# EAGLE design amp (EAGLE 9.6.1)
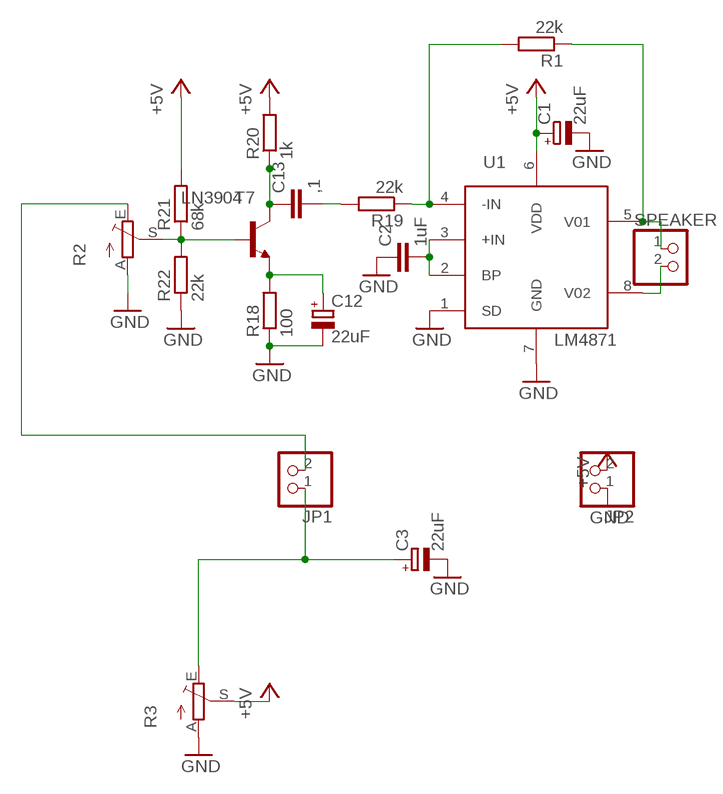
[diagram p0: schematic, sheet 1]

## Parts
C1  22uF  CPOL-EUCT3528  [CT3528]
C2  1uF  C-EUC0603  [C0603]
C3  22uF  CPOL-EUCT3528  [CT3528]
C12  22uF  CPOL-EUCT3528  [CT3528]
C13  ,1  C-EUC0603  [C0603]
JP1  PINHD-1X2  [1X02]
JP2  PINHD-1X2  [1X02]
R1  22k  R-EU_R0603  [R0603]
R2  TRIM_EU-LI15  [LI15]
R3  TRIM_EU-LI15  [LI15]
R18  100  R-EU_R0603  [R0603]
R19  22k  R-EU_R0603  [R0603]
R20  1k  R-EU_R0603  [R0603]
R21  68k  R-EU_R0603  [R0603]
R22  22k  R-EU_R0603  [R0603]
SPEAKER  PINHD-1X2  [1X02]
T7  LN3904  BC848-NPN-SOT23-BEC  [SOT23-BEC]
U1  LM4871  ICS_LM4871  [ICS_SOP08]

## Nets
+5V: C1.+ JP2.2 R3.S R20.2 R21.2 U1.6(VDD)
GND: C1.- C2.1 C3.- C12.- JP2.1 R2.A R3.A R18.1 R22.1 U1.1(SD) U1.7(GND)
N$1: R1.2 R19.1 U1.4(-IN)
N$2: C2.2 U1.2(BP) U1.3(+IN)
N$3: R1.1 SPEAKER.1 U1.5(V01)
N$4: SPEAKER.2 U1.8(V02)
N$5: JP1.2 R2.E
N$6: C3.+ JP1.1 R3.E
N$22: C12.+ R18.2 T7.E
N$23: C13.1 R20.1 T7.C
N$24: C13.2 R19.2
N$25: R2.S R21.1 R22.2 T7.B

## Library data of the parts
C1 C3 C12 = rcl:CPOL-EU: POLARIZED CAPACITOR, European symbol
C2 C13 = rcl:C-EU: CAPACITOR, European symbol
JP1 JP2 SPEAKER = pinhead:PINHD-1X2: PIN HEADER
R1 R18-R22 = resistor:R-EU_: RESISTOR, European symbol
R2 R3 = pot:TRIM_EU-: POTENTIOMETER
T7 = transistor:*-NPN-: NPN Transistror BF959 corrected 2008.03.06
U1 = magictale:ICS_LM4871

## Net classes
1 power: width 0.508 mm, drill 0.508 mm, clearance 0.254 mm

## Board
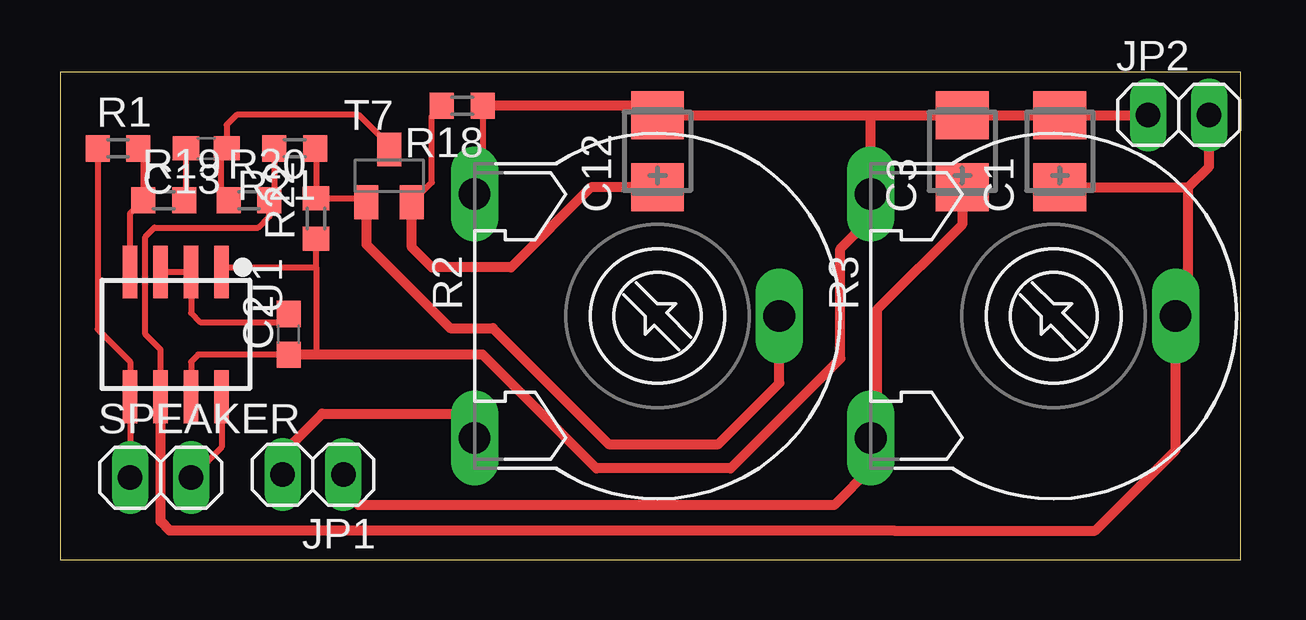
[diagram p1: board, top side]

Size 49.2 x 20.31 mm. Coordinates in mm from the lower left corner, seen from the top.
Outline: 0,0 49.2,0 49.2,20.31 0,20.31 0,0
Copper layers (1*16): Top 0.035mm / dielectric 1.5mm / Bottom 0.035mm
Design rules "default": minimum track width 6mil, minimum drill 0.35mm, track to track 6mil, track to pad 6mil, pad to pad 6mil, via to via 6mil, smd to smd 6mil, copper to edge 40mil, drill to drill 6mil, minimum pad ring 10mil, minimum via ring 8mil, stop-mask expansion 4mil, vias tented up to drill 0mil, thermal gap 10mil

### Footprints (pad centres in the part's own frame; a part is rotated, then mirrored left to right if it is on the bottom)
CT3528 = smd 2 x 2.2: + -1.5,0; - 1.5,0
C0603 = smd 1.1 x 1: 1 -0.85,0; 2 0.85,0
1X02 = drill 1.016 long: 1 -1.27,0; 2 1.27,0
R0603 = smd 1 x 1.1: 1 -0.85,0; 2 0.85,0
LI15 = drill 1.321 long: A -5.08,-7.62; E 5.08,-7.62; S 0,5.08
SOT23-BEC = smd 1 x 1.4: B -0.95,-1.1; C 0,1.1; E 0.95,-1.1
ICS_SOP08 = smd 0.6 x 2.2: 1 -1.905,-2.6; 2 -0.635,-2.6; 3 0.635,-2.6; 4 1.905,-2.6; 5 1.905,2.6; 6 0.635,2.6; 7 -0.635,2.6; 8 -1.905,2.6

### Placement (x,y rotation side)
C1  41.66,17.02 90 top
C2  9.53,9.4 90 top
C3  37.59,17.02 90 top
C12  24.89,17.02 90 top
C13  6.1,17.14 180 top
JP1  10.54,3.56 180 top
JP2  46.61,18.54 0 top
R1  2.41,17.14 0 top
R2  24.89,10.16 270 top
R3  41.4,10.16 270 top
R18  16.76,18.92 180 top
R19  4.32,14.99 0 top
R20  7.87,14.99 0 top
R21  9.78,17.14 180 top
R22  10.67,14.22 90 top
SPEAKER  4.19,3.43 0 top
T7  13.72,16 0 top
U1  4.83,9.4 180 top

### Tracks (layer width: path | path; a pad name or v marks a point on that pad's centre or on a via)
+5V
  Top 0.254: R21.2 8.93,15.19 R20.2 8.72,14.31 8.26,13.84 3.94,13.84 3.56,13.46 3.56,9.4 4.19,8.76 U1.6
  Top 0.406: C1.+ 47.01,15.52 | JP2.2 47.88,16.38 47.01,15.52 | 46.48,10.69 R3.S | U1.6 4.19,1.6 4.57,1.22 34.54,1.22 34.75,1.22 43.13,1.22 46.48,4.57 R3.S | R3.S 46.48,10.92 47.01,11.45 47.01,15.52
GND
  Top 0.254: C2.1 5.75,8.55 5.46,8.26 U1.7 | U1.1 6.92,12.19 10.67,12.19 | 10.67,12.19 R22.1 | R18.1 17.61,15.58 R2.A | 10.67,12.19 10.67,8.55
  Top 0.406: R18.1 24.49,18.92 C12.- 33.78,18.52 | 33.78,18.52 C3.- C1.- 45.31,18.52 JP2.1 | 33.78,18.52 R3.A 33.78,14.22 32.51,12.95 32.51,8.38 27.94,3.81 22.35,3.81 17.61,8.55 10.67,8.55 C2.1
N$1
  Top 0.254: U1.4 2.92,14.44 R19.1 3.47,16.94 R1.2
N$2
  Top 0.254: U1.3 U1.2 5.46,10.29 5.84,9.91 9.18,9.91 C2.2
N$3
  Top 0.254: R1.1 1.56,9.61 2.92,8.26 U1.5 SPEAKER.1
N$4
  Top 0.254: U1.8 6.73,4.7 SPEAKER.2
N$5
  Top 0.406: JP1.2 9.27,4.45 10.92,6.1 16.76,6.1 17.27,5.59 R2.E
N$6
  Top 0.406: C3.+ 37.59,13.97 34.04,10.41 34.04,5.33 R3.E 33.78,3.81 32.26,2.29 12.45,2.29 11.81,2.92 JP1.1
N$22
  Top 0.254: T7.E 15.49,15.73 15.49,18.5 R18.2
  Top 0.406: C12.+ 22.12,15.52 18.8,12.19 15.49,12.19 14.67,13.02 T7.E
N$23
  Top 0.254: R20.1 6.69,15.32 6.69,17.02 6.82,17.14 C13.1 6.95,18.12 7.37,18.54 12.45,18.54 13.46,17.53 13.46,17.61 13.72,17.36 T7.C
N$24
  Top 0.254: C13.2 5.25,15.06 R19.2
N$25
  Top 0.254: R21.1 10.67,17.11 R22.2 12.59,15.07 T7.B
  Top 0.406: T7.B 12.77,13.14 16.26,9.65 18.03,9.65 22.86,4.83 27.43,4.83 29.97,7.37 R2.S